# EAGLE design Schaltplan_Test_2 (EAGLE 8.2.1)
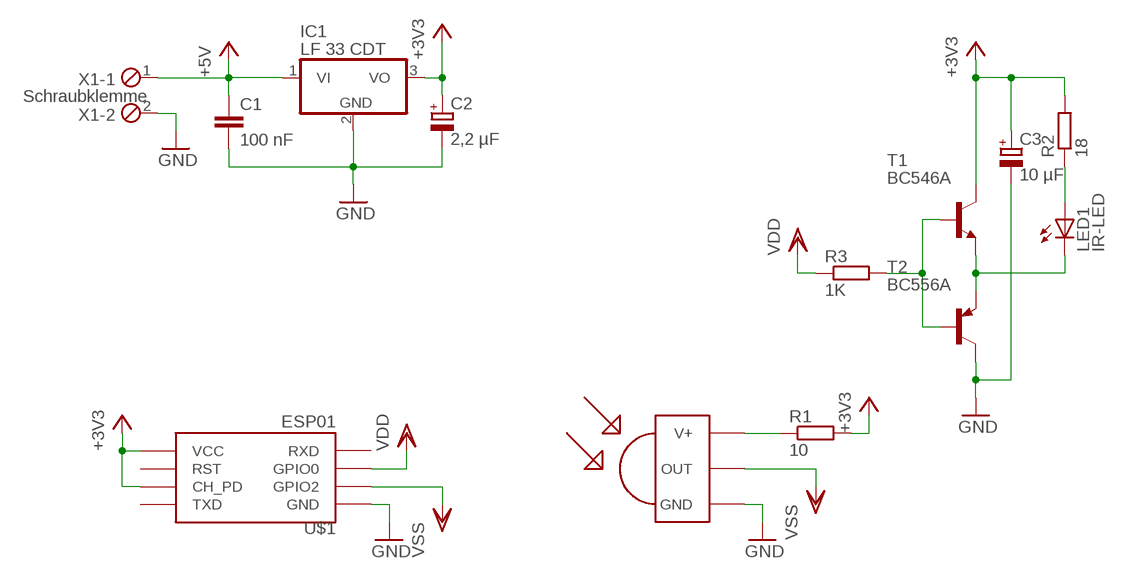
[diagram p0: schematic, sheet 1]

## Parts
C1  100 nF  C-EU025-024X044  [C025-024X044]
C2  2,2 µF  CPOL-EUE2.5-5  [E2,5-5]
C3  10 µF  CPOL-EUE2.5-5  [E2,5-5]
IC1  LF 33 CDT  MC78M05ABT  [TO220V]
IR-TRANSMITTER  TSOP1833  [TSOP18XX]
LED1  IR-LED  LED5MM  [LED5MM]
R1  10  R-EU_0204/7  [0204/7]
R2  18  R-EU_0204/5  [0204/5]
R3  1K  R-EU_0204/5  [0204/5]
T1  BC546A  [TO92-EBC]
T2  BC556A  [TO92-EBC]
U$1  ESP01  [ESP01]
X1  Schraubklemme  MPT2  [2POL254]

## Nets
+3V3: C2.+ C3.+ IC1.3(VO) R1.2 R2.2 T1.C U$1.CH_PD U$1.VCC
+5V: C1.1 IC1.1(VI) X1.1
GND: C1.2 C2.- C3.- IC1.2(GND) IR-TRANSMITTER.GND T2.C U$1.GND X1.2
N$1: IR-TRANSMITTER.VCC(V+) R1.1
N$2: R3.2 T1.B T2.B
N$8: LED1.K(C) T1.E T2.E
N$10: LED1.A R2.1
VDD: R3.1 U$1.GPIO0
VSS: IR-TRANSMITTER.OUT U$1.GPIO2
Unconnected: U$1.RST U$1.RX(RXD) U$1.TX(TXD)

## Library data of the parts
C1 = rcl:C-EU: CAPACITOR, European symbol
C2 C3 = rcl:CPOL-EU: POLARIZED CAPACITOR, European symbol
IC1 = linear:MC78M: 500 mA Positive Voltage Regulators Source: Data sheet <http://www.onsemi.com/pub_link/Collateral/MC78M00-D.PDF>
IR-TRANSMITTER = tsop:TSOP1833: IR Receiver and Demodulator
LED1 = led:LED: LED OSRAM: - CHIPLED LG R971, LG N971, LY N971, LG Q971, LY Q971, LO R971, LY R971 LH N974, LH R974 LS Q976, LO Q976, LY Q976 LO Q996 - Hyper CHIPLED LW Q18S LB Q993, LB Q99A, LB R99A - SideLED LS A670, LO A670, LY A670, LG A670, LP A670 LB A673, LV A673, LT A673, LW A673 LH A674 LY A675 LS A676, LA A676, LO A676, LY A676, LW A676 LS A679, LY A679, LG A679 - Hyper Micro SIDELED® LS Y876, LA Y876, LO Y876, LY Y876 LT Y87S - SmartLED LW L88C, LW L88S LB L89C, LB L89S, LG L890 LS L89K, LO L89K, LY L89K LS L896, LA L896, LO L896, LY L896 - TOPLED LS T670, LO T670, LY T670, LG T670, LP T670 LSG T670, LSP T670, LSY T670, LOP T670, LYG T670 LG T671, LOG T671, LSG T671 LB T673, LV T673, LT T673, LW T673 LH T674 LS T676, LA T676, LO T676, LY T676, LB T676, LH T676, LSB T676, LW T676 LB T67C, LV T67C, LT T67C, LS T67K, LO T67K, LY T67K, LW E67C LS E67B, LA E67B, LO E67B, LY E67B, LB E67C, LV E67C, LT E67C LW T67C LS T679, LY T679, LG T679 LS T770, LO T770, LY T770, LG T770, LP T770 LB T773, LV T773, LT T773, LW T773 LH T774 LS E675, LA E675, LY E675, LS T675 LS T776, LA T776, LO T776, LY T776, LB T776 LHGB T686 LT T68C, LB T68C - Hyper Mini TOPLED® LB M676 - Mini TOPLED Santana® LG M470 LS M47K, LO M47K, LY M47K Source: http://www.osram.convergy.de LUXEON: - LUMILED® LXK2-PW12-R00, LXK2-PW12-S00, LXK2-PW14-U00, LXK2-PW14-V00 LXK2-PM12-R00, LXK2-PM12-S00, LXK2-PM14-U00 LXK2-PE12-Q00, LXK2-PE12-R00, LXK2-PE12-S00, LXK2-PE14-T00, LXK2-PE14-U00 LXK2-PB12-K00, LXK2-PB12-L00, LXK2-PB12-M00, LXK2-PB14-N00, LXK2-PB14-P00, LXK2-PB14-Q00 LXK2-PR12-L00, LXK2-PR12-M00, LXK2-PR14-Q00, LXK2-PR14-R00 LXK2-PD12-Q00, LXK2-PD12-R00, LXK2-PD12-S00 LXK2-PH12-R00, LXK2-PH12-S00 LXK2-PL12-P00, LXK2-PL12-Q00, LXK2-PL12-R00 Source: www.luxeon.com KINGBRIGHT: KA-3528ASYC Source: www.kingbright.com
R1-R3 = resistor:R-EU_: RESISTOR, European symbol
T1 = transistor-npn:BC546*: NPN Transistor
T2 = transistor-pnp:BC556*: PNP Transistror
U$1 = esp8266modules:ESP01: ESP8266 Wifi module 01
X1 = con-phoenix-254:MPT2: PHOENIX CONNECTOR; OC_FARNELL: unknown; OC_NEWARK: unknown

## Board
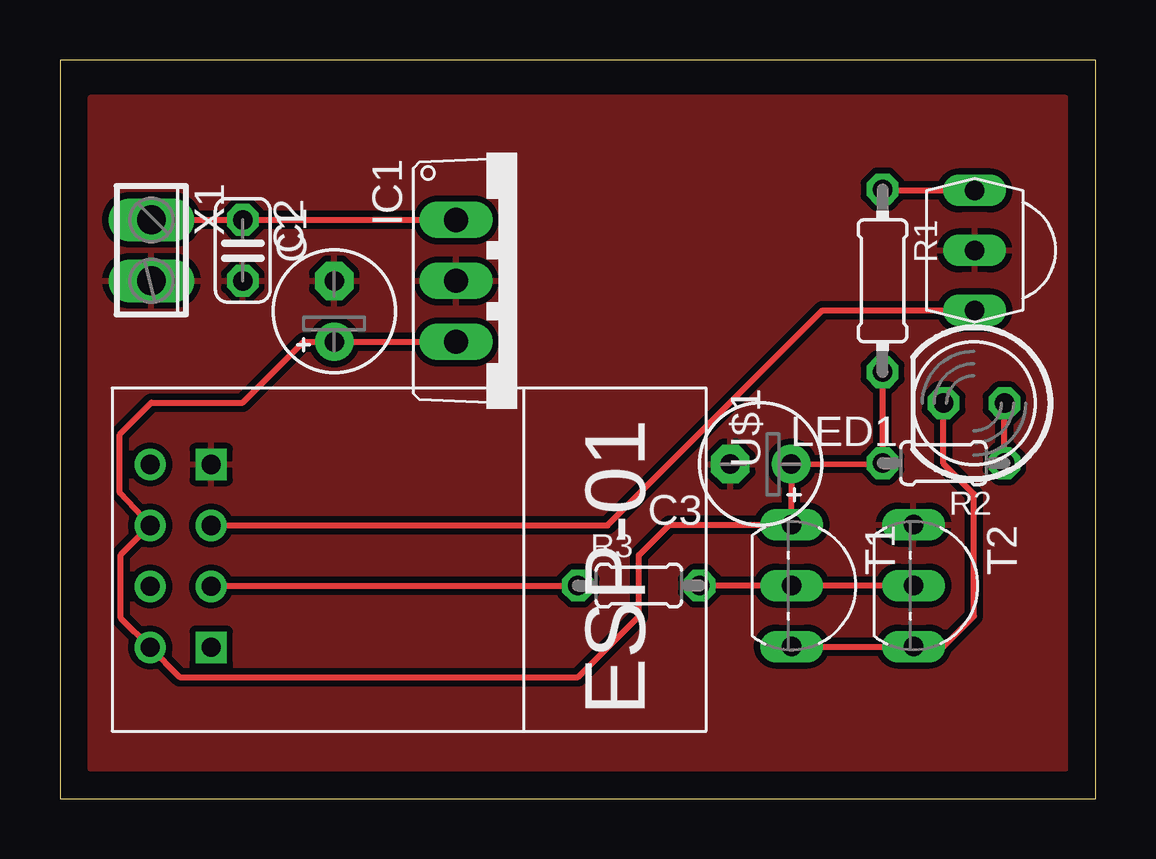
[diagram p1: board, top side]

Size 43.17 x 30.79 mm. Coordinates in mm from the lower left corner, seen from the top.
Outline: 0,0 43.17,0 43.17,30.79 0,30.79 0,0
Copper layers (1*16): Top 0.035mm / dielectric 1.5mm / Bottom 0.035mm
Design rules "default *": minimum track width 6mil, minimum drill 0.35mm, track to track 10mil, track to pad 10mil, pad to pad 10mil, via to via 6mil, smd to smd 6mil, copper to edge 40mil, drill to drill 6mil, minimum pad ring 10mil, minimum via ring 8mil, stop-mask expansion 4mil, vias tented up to drill 0mil, thermal gap 10mil

### Footprints (pad centres in the part's own frame; a part is rotated, then mirrored left to right if it is on the bottom)
C025-024X044 = drill 0.813 octagon: 1 -1.27,0; 2 1.27,0
E2,5-5 = drill 0.813 pad 1.6: + -1.27,0 | drill 0.813 pad 1.6 octagon: - 1.27,0
TO220V = drill 1.016 long: 1 -2.54,-2.54; 2 0,-2.54; 3 2.54,-2.54
TSOP18XX = drill 0.813 long: GND -0.001,-0.027; OUT -2.501,-0.027; VCC 2.499,-0.027
LED5MM = drill 0.813 octagon: A -1.27,0; K 1.27,0
0204/7 = drill 0.813 octagon: 1 -3.81,0; 2 3.81,0
0204/5 = drill 0.813 octagon: 1 -2.54,0; 2 2.54,0
TO92-EBC = drill 0.813 long: B 0,-1.27; C -2.54,-1.27; E 2.54,-1.27
ESP01 = drill 0.8: CH_PD -1.285,-8.178; GPIO0 1.255,-5.638; GPIO2 -1.285,-5.638; RST 1.255,-8.178; TX -3.825,-8.178; VCC 3.795,-8.178 | drill 0.8 square: GND -3.825,-5.638; RX 3.795,-5.638
2POL254 = drill 1.2 long: 1 -1.27,0; 2 1.27,0

### Placement (x,y rotation side)
C1  7.62,22.86 270 top
C2  11.43,20.32 90 top
C3  29.21,13.95 180 top
IC1  19.05,21.59 270 top
IR-TRANSMITTER  38.1,22.86 90 top
LED1  38.1,16.49 180 top
R1  34.29,21.59 270 top
R2  36.83,13.99 180 top
R3  24.13,8.89 0 top
T1  31.77,8.89 270 top
T2  36.85,8.89 270 top
U$1  11.94,10.11 270 top
X1  3.81,22.86 270 top

### Tracks (layer width: path | path; a pad name or v marks a point on that pad's centre or on a via)
+3V3
  Top 0.254: IC1.3 C2.+ 10.16,19.05 7.62,16.51 3.81,16.51 2.49,15.19 2.49,12.75 U$1.CH_PD 2.54,10.18 2.54,7.54 U$1.VCC 5,5.08 21.59,5.08 24.13,7.62 24.13,10.16 25.4,11.43 T1.C 30.46,11.47 C3.+ 34.27,13.97 R2.2 R1.2
+5V
  Top 0.254: X1.1 C1.1 IC1.1
GND
  pour Top: 1.27,1.27 41.91,1.27 41.91,29.21 1.27,29.21
N$1
  Top 0.254: R1.1 34.33,25.36 IR-TRANSMITTER.VCC
N$2
  Top 0.254: T2.B T1.B R3.2
N$8
  Top 0.254: T1.E T2.E 36.83,6.35 38.1,7.62 38.1,12.7 36.83,13.97 LED1.K
N$10
  Top 0.254: R2.1 LED1.A
VDD
  Top 0.254: U$1.GPIO0 6.3,8.89 R3.1
VSS
  Top 0.254: U$1.GPIO2 22.83,11.4 31.79,20.36 IR-TRANSMITTER.OUT